# EAGLE design untitled (EAGLE 7.1.0)
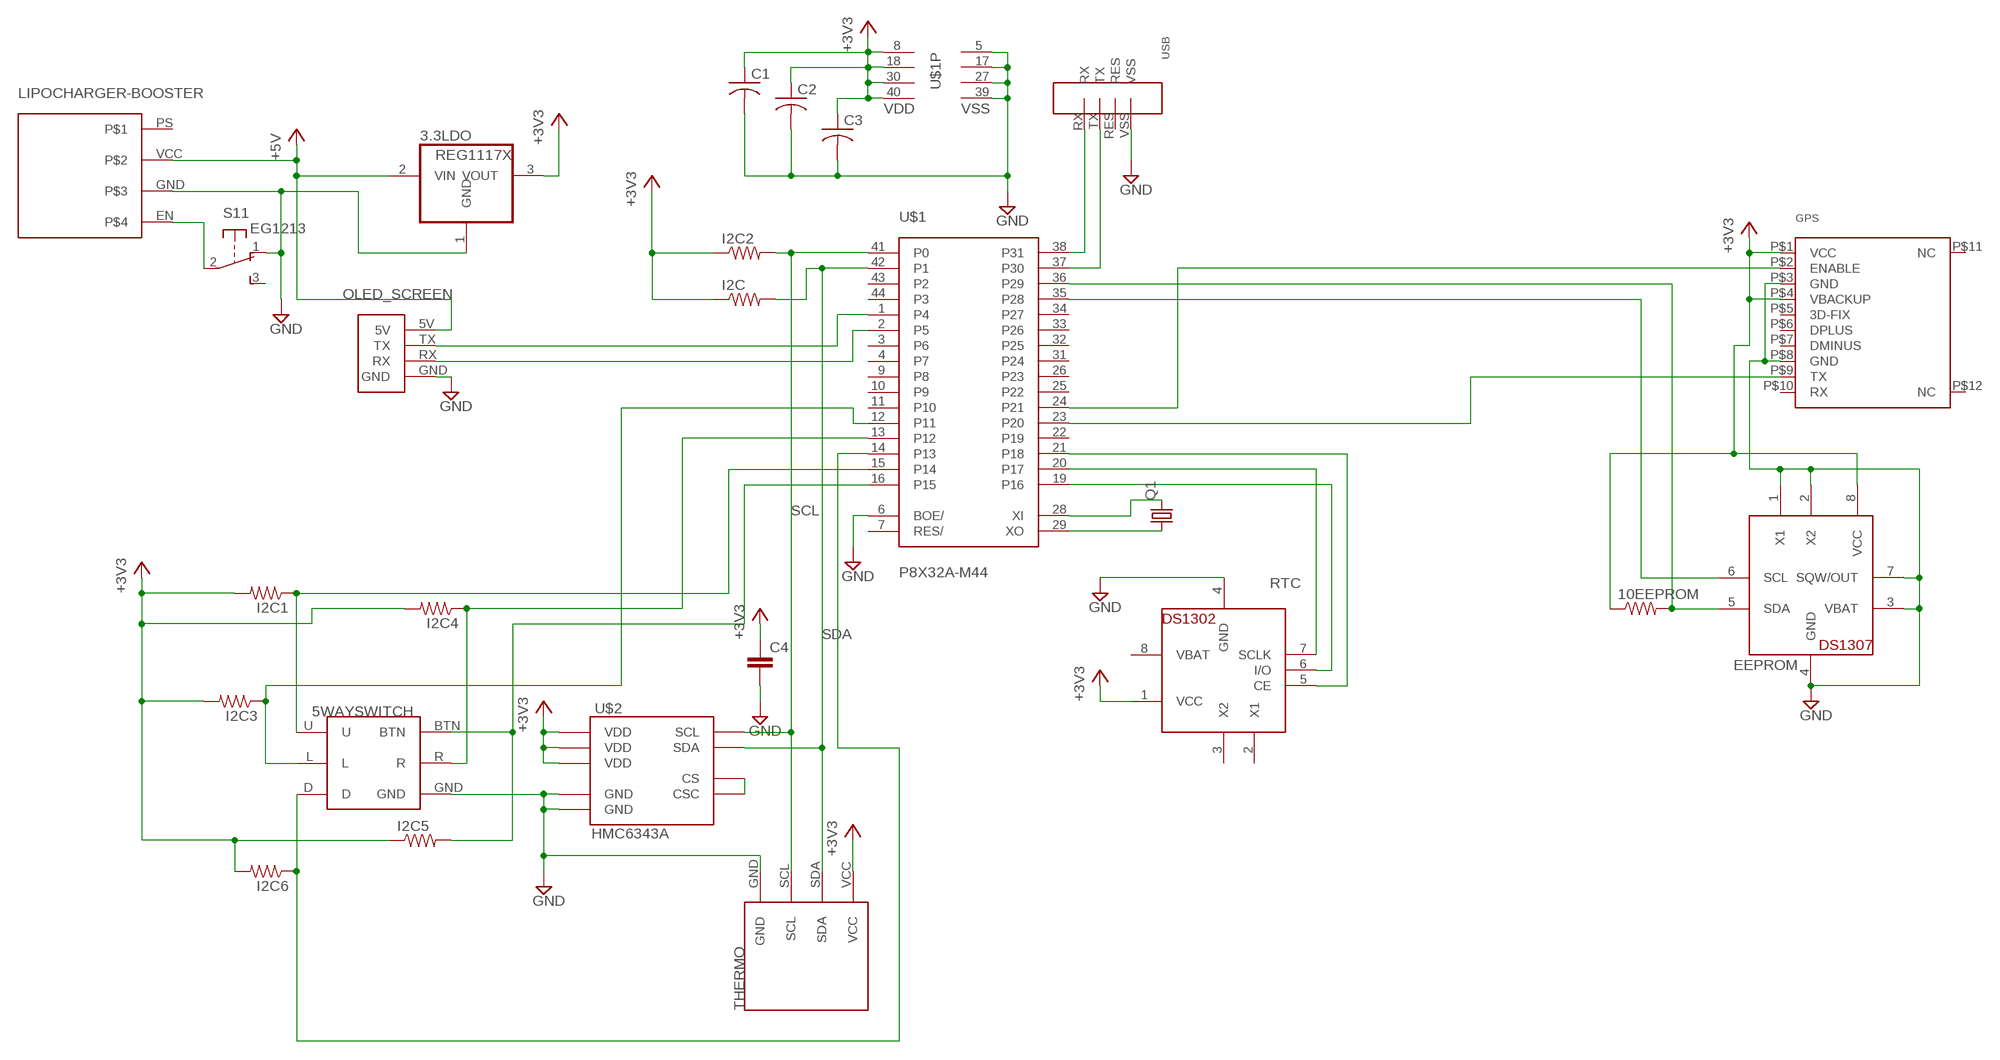
[diagram p0: schematic, sheet 1]

## Parts
3.3LDO  REG1117X  [TO252]
5WAYSWITCH  5-WAYSWITCH  [5-WAYSWITCH]
10EEPROM  R-US_R1005  [R1005]
C1  C-USC0603  [C0603]
C2  C-USC0603  [C0603]
C3  C-USC0603  [C0603]
C4  CAP0603  [0603]
EEPROM  DS1307  [DIL08]
GPS  GPS_FGPMMOPA6B  [FGPMMOPA6B]
I2C  R-US_R1005  [R1005]
I2C1  R-US_R1005  [R1005]
I2C2  R-US_R1005  [R1005]
I2C3  R-US_R1005  [R1005]
I2C4  R-US_R1005  [R1005]
I2C5  R-US_R1005  [R1005]
I2C6  R-US_R1005  [R1005]
LIPOCHARGER-BOOSTER  SFLIPO  [SFLIPO]
OLED_SCREEN  4DSCREEN  [4DSCREEN]
Q1  CRYSTALHC49S  [HC49/S]
RTC  DS1302  [DIL08-ROUND]
S1  EG1213  [EG1213]
THERMO  SFTEMP  [SFTEMP]
U$1  P8X32A-M44  [P8X32A-M44]
U$2  HMC6343A  [LCC36]
USB  4PINUSB  [4PINUSB]

## Nets
+3V3: 3.3LDO.3(VOUT) 10EEPROM.1 C1.1 C2.1 C3.1 C4.1 EEPROM.8(VCC) GPS.P$1(VCC) GPS.P$4(VBACKUP) I2C1.2 I2C2.1 I2C3.2 I2C4.2 I2C5.1 I2C6.2 I2C.1 RTC.1(VCC) THERMO.VCC U$1.8(VDD) U$1.18(VDD) U$1.30(VDD) U$1.40(VDD) U$2.3(VDD) U$2.11(VDD) U$2.21(VDD)
+5V: 3.3LDO.2(VIN) LIPOCHARGER-BOOSTER.VCC OLED_SCREEN.5V
GND: 3.3LDO.1(GND) 5WAYSWITCH.GND C1.2 C2.2 C3.2 C4.2 EEPROM.1(X1) EEPROM.2(X2) EEPROM.3(VBAT) EEPROM.4(GND) EEPROM.7(SQW/OUT) GPS.P$3(GND) GPS.P$8(GND) LIPOCHARGER-BOOSTER.GND OLED_SCREEN.GND RTC.4(GND) S1.1(1:O) THERMO.GND U$1.5(VSS) U$1.6(BOE/) U$1.17(VSS) U$1.27(VSS) U$1.39(VSS) U$2.25(GND) U$2.29(GND) USB.VSS
N$1: Q1.2 U$1.28(XI)
N$2: Q1.1 U$1.29(XO)
N$3: GPS.P$9(TX) U$1.23(P20)
N$4: GPS.P$2(ENABLE) U$1.24(P21)
N$5: RTC.5(CE) U$1.21(P18)
N$6: RTC.6(I/O) U$1.19(P16)
N$7: U$1.38(P31) USB.RX
N$8: RTC.7(SCLK) U$1.20(P17)
N$9: U$1.37(P30) USB.TX
N$10: OLED_SCREEN.RX U$1.2(P5)
N$11: OLED_SCREEN.TX U$1.1(P4)
N$13: LIPOCHARGER-BOOSTER.EN S1.2(1:P)
N$14: 5WAYSWITCH.U I2C1.1 U$1.15(P14)
N$15: 5WAYSWITCH.D I2C6.1 U$1.14(P13)
N$17: 5WAYSWITCH.L I2C3.1 U$1.12(P11)
N$18: 10EEPROM.2 EEPROM.5(SDA) U$1.36(P29)
N$19: EEPROM.6(SCL) U$1.35(P28)
N$20: 5WAYSWITCH.R I2C4.1 U$1.13(P12)
N$21: 5WAYSWITCH.BTN I2C5.2 U$1.16(P15)
N$22: U$2.22(CS) U$2.35(CSC)
SCL: I2C2.2 THERMO.SCL U$1.41(P0) U$2.32(SCL)
SDA: I2C.2 THERMO.SDA U$1.42(P1) U$2.36(SDA)
Unconnected: GPS.P$5(3D-FIX) GPS.P$6(DPLUS) GPS.P$7(DMINUS) GPS.P$10(RX) GPS.P$11(NC) GPS.P$12(NC) LIPOCHARGER-BOOSTER.PS RTC.2(X1) RTC.3(X2) S1.3(1:S) S1.MT1(MT) S1.MT2(MT) U$1.3(P6) U$1.4(P7) U$1.7(RES/) U$1.9(P8) U$1.10(P9) U$1.11(P10) U$1.22(P19) U$1.25(P22) U$1.26(P23) U$1.31(P24) U$1.32(P25) U$1.33(P26) U$1.34(P27) U$1.43(P2) U$1.44(P3) USB.RES

## Power pins joined to a net without a drawn wire
VBAT: RTC.8(VBAT)

## Library data of the parts
3.3LDO = burr-brown:REG1117: 800mA and 1A Low Dropout (LDO) Positive Regulator 1.8V, 2.5V, 2.85V, 3.3V, 5V, and Adj
5WAYSWITCH = 5-wayswitch:5-WAYSWITCH
10EEPROM I2C I2C1-I2C6 = adafruit:R-US_: RESISTOR, American symbol
C1-C3 = rcl:C-US: CAPACITOR, American symbol
C4 = SparkFun:CAP: Capacitor Standard 0603 ceramic capacitor, and 0.1" leaded capacitor.
EEPROM = adafruit:DS1307: DS1307 Real time clock (RTC) with battery backup ability. Talk to it via i2c
GPS = adafruit:GPS_FGPMMOPA6B: FGPMMOPA6B 16x16x0.6mm GPS Module NMEA Sentences: GGA, GSA, GSV, RMC, VTG General Specifications Chipset: MTK MT3329 Baud Rate: 9600bps (default) Update Rate: 1Hz (default) Cold Start: ~35s Operating Temp: -40 to 85°C DC Characteristics Supply Voltage: 3.2-5.0V Backup Battery Voltage: 2.0-4.3V Digital Logic (UART): 3.3V I(Tracking): 42mA I(Acquisition): 53mA I(BackupBattery): 10uA
LIPOCHARGER-BOOSTER = SFLipoPack:SFLIPO
OLED_SCREEN = 4dScreen:4DSCREEN
Q1 = crystal:CRYSTAL: CRYSTAL; OC_FARNELL: 1667008; OC_NEWARK: unknown
RTC = adafruit:DS1302: DS1302 - Real time clock with supercap trickle charger
S1 = adafruit:EG1213: E-Switch right-angle slide SPDT Part #EG1213 http://www.ladyada.net/library/eagle
THERMO = SFTemp:SFTEMP
U$1 = parallax_propeller:P8X32A-M44
U$2 = SparkFun:HMC6343
USB = 4pinUSB:4PINUSB

## Board
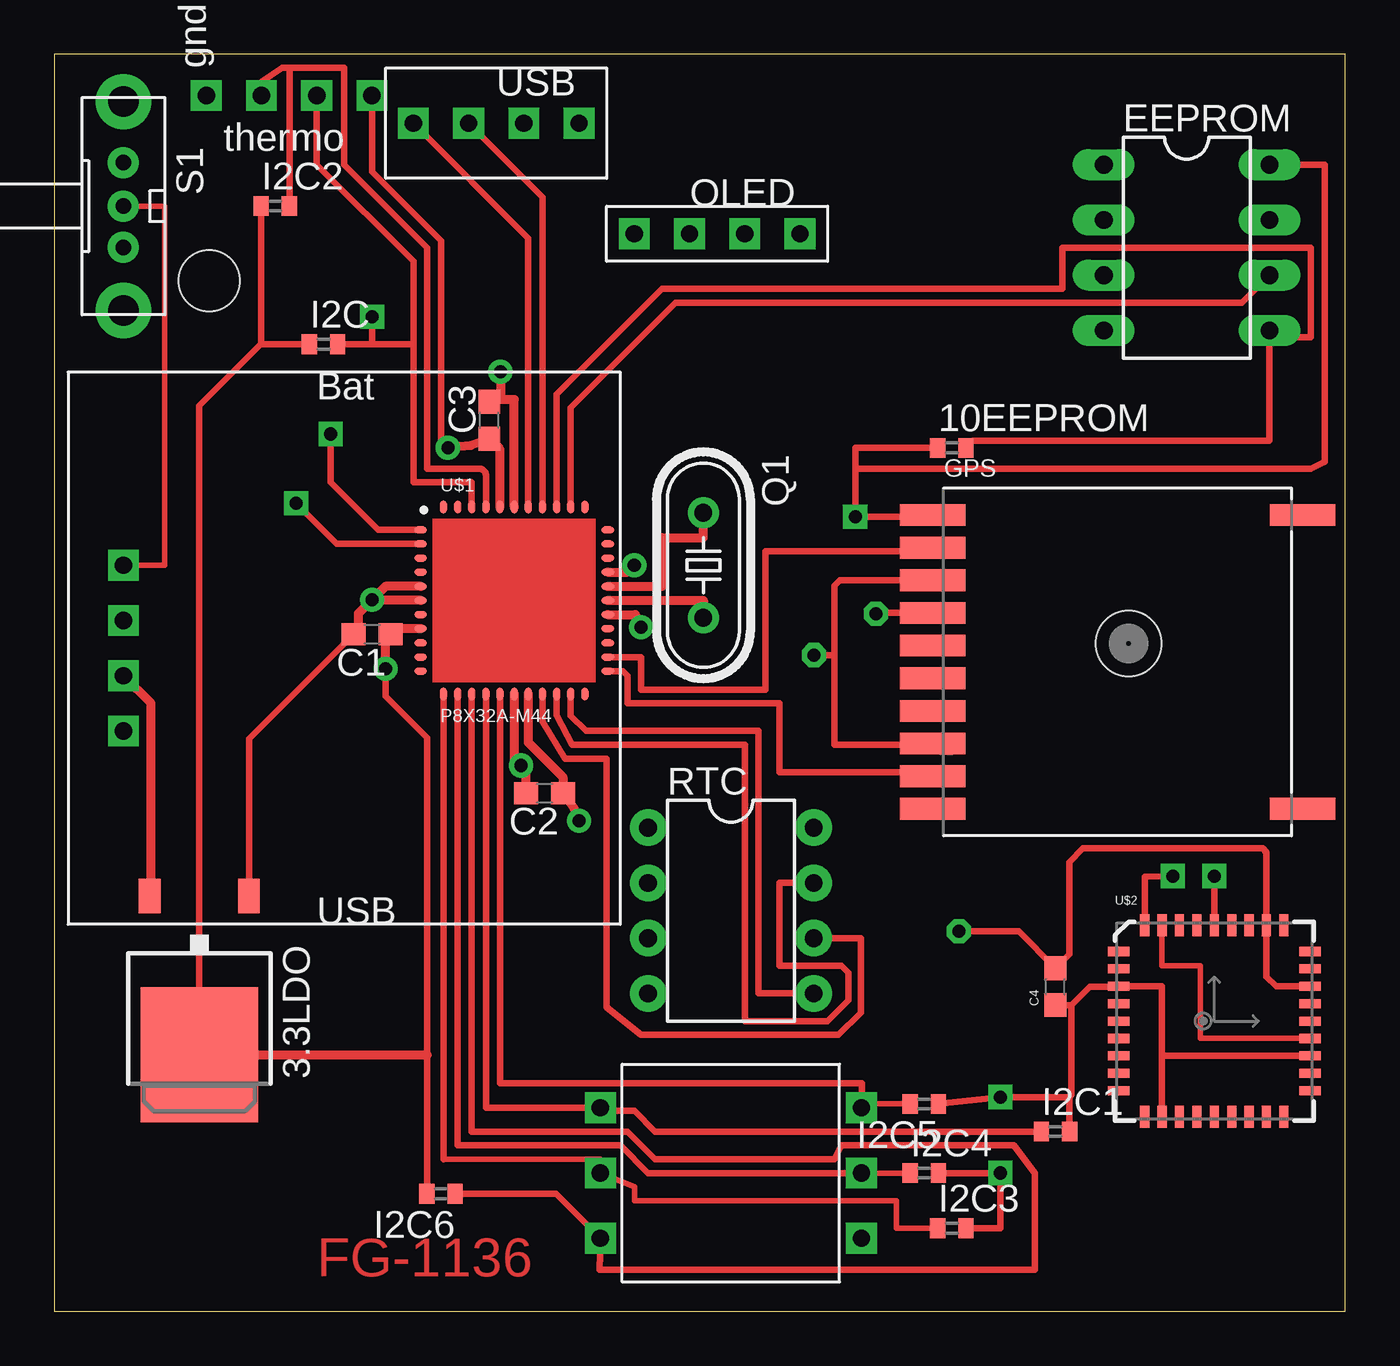
[diagram p1: board, top side]
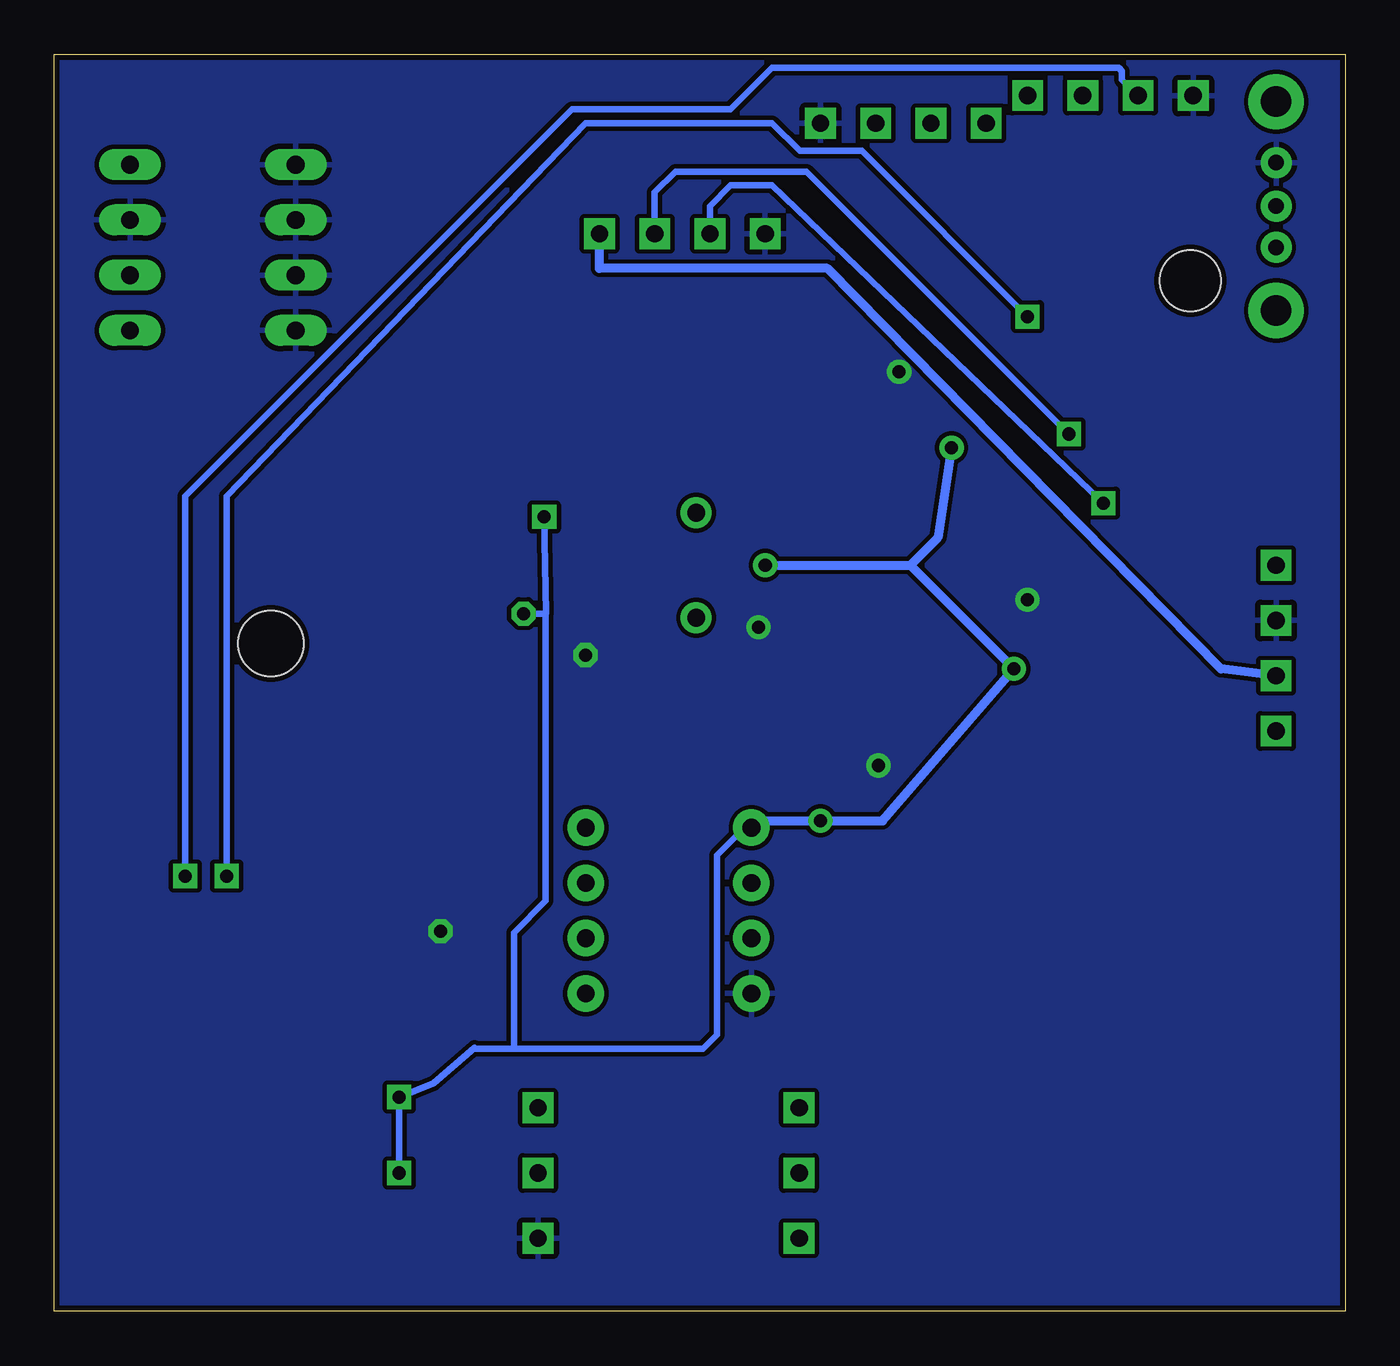
[diagram p2: board, bottom side, seen from below]

Size 59.36 x 57.78 mm. Coordinates in mm from the lower left corner, seen from the top.
Outline: 0,0 59.36,0 59.36,57.78 0,57.78 0,0
Copper layers (1*16): Top 0.035mm / dielectric 1.5mm / Bottom 0.035mm
Design rules "SparkFun": minimum track width 8mil, minimum drill 20mil, track to track 8mil, track to pad 8mil, pad to pad 8mil, via to via 8mil, smd to smd 8mil, copper to edge 10mil, drill to drill 8mil, minimum pad ring 12mil, minimum via ring 10mil, stop-mask expansion 4mil, vias tented up to drill 25mil, thermal gap 10mil
Holes 2.8 mm at 7.11,47.37

### Footprints (pad centres in the part's own frame; a part is rotated, then mirrored left to right if it is on the bottom)
TO252 = smd 1 x 1.6: 1 -2.28,-4.8; 2 2.28,-4.8 | smd 5.4 x 6.2: 3 0,2.5
5-WAYSWITCH = drill 0.8 square: BTN 6,3; D -6,-3; GND 6,-3; L -6,0; R 6,0; U -6,3
R1005 = smd 0.7 x 0.9: 1 -0.65,0; 2 0.65,0
C0603 = smd 1.1 x 1: 1 -0.85,0; 2 0.85,0
0603 = smd 1.1 x 1: 1 -0.85,0; 2 0.85,0
DIL08 = drill 0.813 long: 1 -3.81,-3.81; 2 -1.27,-3.81; 3 1.27,-3.81; 4 3.81,-3.81; 5 3.81,3.81; 6 1.27,3.81; 7 -1.27,3.81; 8 -3.81,3.81
FGPMMOPA6B = smd 3 x 1: P$1 -8.5,6.75; P$2 -8.5,5.25; P$3 -8.5,3.75; P$4 -8.5,2.25; P$5 -8.5,0.75; P$6 -8.5,-0.75; P$7 -8.5,-2.25; P$8 -8.5,-3.75; P$9 -8.5,-5.25; P$10 -8.5,-6.75; P$11 8.5,6.75; P$12 8.5,-6.75 | hole 3: 0.5,0.85
SFLIPO = drill 0.8 square: EN -5.08,2.54; GND -5.08,0; PS -5.08,-5.08; VCC -5.08,-2.54
4DSCREEN = drill 0.8 square: 5V 0,2.54; GND 0,-5.08; RX 0,-2.54; TX 0,0
HC49/S = drill 0.813: 1 -2.413,0; 2 2.413,0
DIL08-ROUND = drill 0.813 pad 1.676: 1 -3.81,-3.81; 2 -1.27,-3.81; 3 1.27,-3.81; 4 3.81,-3.81; 5 3.81,3.81; 6 1.27,3.81; 7 -1.27,3.81; 8 -3.81,3.81
EG1213 = drill 0.7 pad 1.422: 1 -2,0; 2 0,0; 3 1.9,0 | drill 1.4 pad 2.54: MT1 -4.8,0; MT2 4.8,0
SFTEMP = drill 0.8 square: GND 0,2.54; SCL 0,0; SDA 0,-2.54; VCC 0,-5.08
P8X32A-M44 = smd 0.6 x 0.33: 1 -4.11,2.901; 2 -4.11,2.251; 3 -4.11,1.601; 4 -4.11,0.951; 5 -4.11,0.301; 6 -4.11,-0.349; 7 -4.11,-0.999; 8 -4.11,-1.649; 9 -4.11,-2.299; 10 -4.11,-2.949; 11 -4.11,-3.599; 23 4.49,-3.599; 24 4.49,-2.949; 25 4.49,-2.299; 26 4.49,-1.649; 27 4.49,-0.999; 28 4.49,-0.349; 29 4.49,0.301; 30 4.49,0.951; 31 4.49,1.601; 32 4.49,2.251; 33 4.49,2.901 | smd 0.33 x 0.6: 12 -3.06,-4.649; 13 -2.41,-4.649; 14 -1.76,-4.649; 15 -1.11,-4.649; 16 -0.46,-4.649; 17 0.19,-4.649; 18 0.84,-4.649; 19 1.49,-4.649; 20 2.14,-4.649; 21 2.79,-4.649; 22 3.44,-4.649; 34 3.44,3.951; 35 2.79,3.951; 36 2.14,3.951; 37 1.49,3.951; 38 0.84,3.951; 39 0.19,3.951; 40 -0.46,3.951; 41 -1.11,3.951; 42 -1.76,3.951; 43 -2.41,3.951; 44 -3.06,3.951
LCC36 = smd 1 x 0.42: 1 -4.4,3.2; 2 -4.4,2.4; 3 -4.4,1.6; 4 -4.4,0.8; 5 -4.4,0; 6 -4.4,-0.8; 7 -4.4,-1.6; 8 -4.4,-2.4; 9 -4.4,-3.2; 19 4.4,-3.2; 20 4.4,-2.4; 21 4.4,-1.6; 22 4.4,-0.8; 23 4.4,0; 24 4.4,0.8; 25 4.4,1.6; 26 4.4,2.4; 27 4.4,3.2 | smd 0.42 x 1: 10 -3.2,-4.4; 11 -2.4,-4.4; 12 -1.6,-4.4; 13 -0.8,-4.4; 14 0,-4.4; 15 0.8,-4.4; 16 1.6,-4.4; 17 2.4,-4.4; 18 3.2,-4.4; 28 3.2,4.4; 29 2.4,4.4; 30 1.6,4.4; 31 0.8,4.4; 32 0,4.4; 33 -0.8,4.4; 34 -1.6,4.4; 35 -2.4,4.4; 36 -3.2,4.4
4PINUSB = drill 0.8 square: RES 0,1.27; RX 0,-3.81; TX 0,-1.27; VSS 0,3.81

### Placement (x,y rotation side)
3.3LDO  6.67,14.29 180 top
5WAYSWITCH  31.11,6.35 0 top
10EEPROM  41.28,39.69 0 top
C1  14.6,31.11 180 top
C2  22.54,23.81 180 top
C3  20,40.96 90 top
C4  46.04,14.92 90 top
EEPROM  52.07,48.89 270 top
GPS  48.89,29.85 0 top
I2C  12.38,44.45 0 top
I2C1  46.04,8.25 0 top
I2C2  10.16,50.8 0 top
I2C3  41.28,3.81 0 top
I2C4  40,6.35 0 top
I2C5  40,9.52 180 top
I2C6  17.78,5.4 180 top
LIPOCHARGER-BOOSTER  8.25,31.75 0 top
OLED_SCREEN  31.75,49.53 270 top
Q1  29.84,34.29 270 top
RTC  31.11,18.41 270 top
S1  3.17,50.8 270 top
THERMO  9.52,55.88 90 top
U$1  20.95,33.02 0 top
U$2  53.34,13.34 0 top
USB  20.32,54.61 270 top

### Tracks (layer width: path | path; a pad name or v marks a point on that pad's centre or on a via)
+3V3  (via drill 0.6)
  Top 0.305: I2C4.2 v43.5,6.35 43.5,3.81 I2C3.2 | I2C5.1 v43.5,9.84 46.67,9.84 | 46.67,9.84 I2C1.2 | I2C6.2 17.13,11.75 17.13,26.37 15.24,28.26 v15.24,29.53 | GPS.P$1 40.31,36.51 v36.83,36.51 36.83,38.73 | 10EEPROM.1 36.83,39.69 36.83,38.73 | EEPROM.8 58.42,52.7 58.42,39.05 57.78,38.73 36.83,38.73 | THERMO.VCC 14.6,52.39 17.78,49.21 17.78,40 v18.1,39.69 | U$2.21 50.94,11.73 | 50.94,11.73 U$2.11 | 50.94,11.73 50.94,14.93 U$2.3 48.93,14.92 47.62,14.92 46.78,14.07 | C4.1 46.78,14.07 | 46.78,14.07 46.78,9.95 46.67,9.84 | GPS.P$4 37.81,32.09 v37.78,32.07 | I2C.1 9.52,44.45 9.51,44.47 | I2C2.1 9.51,44.47 | 3.3LDO.3 6.67,41.62 9.51,44.47
  Top 0.406: U$1.8 15.45,31.37 C1.1 15.24,30.9 v15.24,29.53 | v24.13,22.54 23.91,23.07 C2.1 23.39,24.55 21.8,26.15 U$1.18 | U$1.30 26.35,33.97 v26.67,34.29 | v18.1,39.69 19.15,39.79 C3.1 20.49,39.61 U$1.40 | 3.3LDO.3 17.13,11.79 17.13,11.75
  Bottom 0.305: v43.5,6.35 v43.5,9.84 41.91,10.48 40.04,12.11 40,12.07 38.23,12.07 | v36.83,36.51 36.76,32.07 36.77,32.07 | v37.78,32.07 36.77,32.07 | RTC.1 27.62,22.22 28.89,20.95 28.89,12.7 29.53,12.07 38.23,12.07 | 36.77,32.07 36.77,18.86 38.23,17.4 38.23,12.07
  Bottom 0.406: v26.67,34.29 20,34.29 | 20,34.29 v15.24,29.53 21.27,22.54 v24.13,22.54 27.3,22.54 RTC.1 | v18.1,39.69 18.73,35.56 20,34.29
+5V
  Top 0.406: LIPOCHARGER-BOOSTER.VCC 4.45,27.94 4.45,19.09 3.3LDO.2
  Bottom 0.406: LIPOCHARGER-BOOSTER.VCC 5.71,29.53 23.81,47.94 34.29,47.94 OLED_SCREEN.5V
GND  (via drill 0.6)
  Top 0.305: U$2.25 56.19,14.93 55.74,15.38 U$2.29 55.74,21.09 55.56,21.27 47.31,21.27 46.67,20.64 46.67,16.41 C4.2 44.35,17.46 v41.59,17.46 | 41.59,26.04 41.28,25.72 40.96,25.72 | 40.96,25.72 40.77,25.72 GPS.P$8 | GPS.P$3 36.14,33.59 35.88,33.34 35.88,30.16 | 35.88,30.16 35.88,26.04 40.64,26.04 40.96,25.72 | v34.92,30.16 35.88,30.16 | 3.3LDO.1 8.95,26.31 C1.2
  Top 0.406: U$1.39 21.14,41.91 20.57,41.91 | U$1.6 14.57,32.67 | 14.57,32.67 13.97,32.07 13.97,31.33 C1.2 | U$1.5 15.22,33.32 v14.6,32.7 14.57,32.67 | U$1.27 26.72,32.02 v26.99,31.43 | C3.2 20,41.91 20.57,41.91 | U$1.17 21.14,25.4 v21.46,25.08 21.69,24.85 C2.2 | v20.51,43.18 20.51,41.97 20.57,41.91
  pour Bottom: 0,57.78 59.37,57.78 59.37,0 0,0
N$1
  Top 0.406: U$1.28 29.84,32.67 Q1.2
N$2
  Top 0.406: U$1.29 27.94,33.32 27.94,35.56 29.84,35.56 Q1.1
N$3
  Top 0.305: GPS.P$9 40.22,24.76 33.34,24.76 33.34,27.94 26.35,27.94 26.35,29.21 26.14,29.42 U$1.23
N$4
  Top 0.305: GPS.P$2 40.22,34.92 32.7,34.92 32.7,28.57 26.99,28.57 26.99,30.07 U$1.24
N$5
  Top 0.305: RTC.5 32.39,14.61 32.39,26.67 24.45,26.67 23.74,27.37 U$1.21
N$6
  Top 0.305: RTC.6 37.08,17.14 37.08,13.72 36.07,12.7 26.99,12.7 25.4,13.97 25.4,25.4 23.49,25.4 22.45,27.08 U$1.19
N$7
  Top 0.305: U$1.38 21.8,49.33 USB.RX
N$8
  Top 0.305: RTC.7 33.34,19.68 33.34,15.88 36.19,15.88 36.51,15.56 36.51,14.29 35.56,13.34 31.75,13.34 31.75,26.04 23.81,26.04 23.09,27.39 U$1.20
N$9
  Top 0.305: U$1.37 22.45,51.22 USB.TX
N$10  (via drill 0.6)
  Top 0.305: U$1.2 12.99,35.27 v11.11,37.15
  Bottom 0.305: OLED_SCREEN.RX 29.21,50.8 28.26,51.75 26.35,51.75 v11.11,37.15
N$11  (via drill 0.6)
  Top 0.305: U$1.1 14.88,35.92 12.7,38.1 v12.7,40.32
  Bottom 0.305: OLED_SCREEN.TX 31.75,51.44 30.8,52.39 24.77,52.39 v12.7,40.32
N$13
  Top 0.254: S1.2 5.08,50.8 5.08,34.29 LIPOCHARGER-BOOSTER.EN
N$14
  Top 0.305: U$1.15 19.84,9.35 5WAYSWITCH.U 25.26,9.21 26.67,9.21 27.62,8.25 I2C1.1
N$15
  Top 0.305: U$1.14 19.2,8.25 26.35,8.25 27.62,6.98 35.88,6.98 36.19,7.62 44.13,7.62 45.08,6.35 45.08,1.9 25.08,1.9 5WAYSWITCH.D 23.07,5.4 I2C6.1
N$17
  Top 0.254: I2C3.1 38.73,3.81 38.73,5.08 26.67,5.08 26.67,5.71 5WAYSWITCH.L 25.12,6.98 17.89,6.98
  Top 0.305: U$1.12 17.89,6.98
N$18
  Top 0.305: 10EEPROM.2 42.24,40 55.88,40 EEPROM.5 56.2,44.77 57.78,44.77 57.78,48.89 46.36,48.89 46.36,46.99 27.94,46.99 23.09,42.14 U$1.36
N$19
  Top 0.305: EEPROM.6 54.61,46.36 28.57,46.36 23.74,41.53 U$1.35
N$20
  Top 0.254: I2C4.1 5WAYSWITCH.R
  Top 0.305: U$1.13 18.55,7.62 26.03,7.62 27.3,6.35 5WAYSWITCH.R 37.15,6.35
N$21
  Top 0.254: I2C5.2 37.11,9.52 5WAYSWITCH.BTN
  Top 0.305: U$1.16 20.49,10.48 37.15,10.48 37.15,9.35 5WAYSWITCH.BTN
N$22
  Top 0.254: U$2.22 52.7,12.54 52.7,15.88 50.94,15.88 U$2.35
SCL  (via drill 0.6)
  Top 0.305: THERMO.SCL 9.52,56.52 10.48,57.15 10.81,57.15 | 10.81,57.15 13.34,57.15 13.34,52.7 17.14,48.89 17.14,38.73 19.53,38.73 arc-90 19.84,38.42 U$1.41 | I2C2.2 10.81,57.15 | U$2.32 v53.34,20
  Bottom 0.305: v53.34,20 53.34,37.47 35.56,55.25 28.26,55.25 26.35,57.15 10.4,57.15 10.26,57 10.26,56.61 THERMO.SCL
SDA  (via drill 0.6)
  Top 0.305: THERMO.SDA 12.06,52.7 16.51,48.26 16.51,44.45 | 16.51,44.45 16.51,38.1 19.2,38.1 U$1.42 | I2C.2 14.6,44.45 | 14.6,44.45 16.51,44.45 | U$2.36 50.14,19.98 v51.44,20 | v14.6,45.72 14.6,44.45
  Bottom 0.305: v51.44,20 51.44,37.47 34.92,54.61 26.35,54.61 25.08,53.34 22.23,53.34 v14.6,45.72

### Text on the board
Top: FG-1136